# EAGLE schematic test_module (EAGLE 9.6.2)
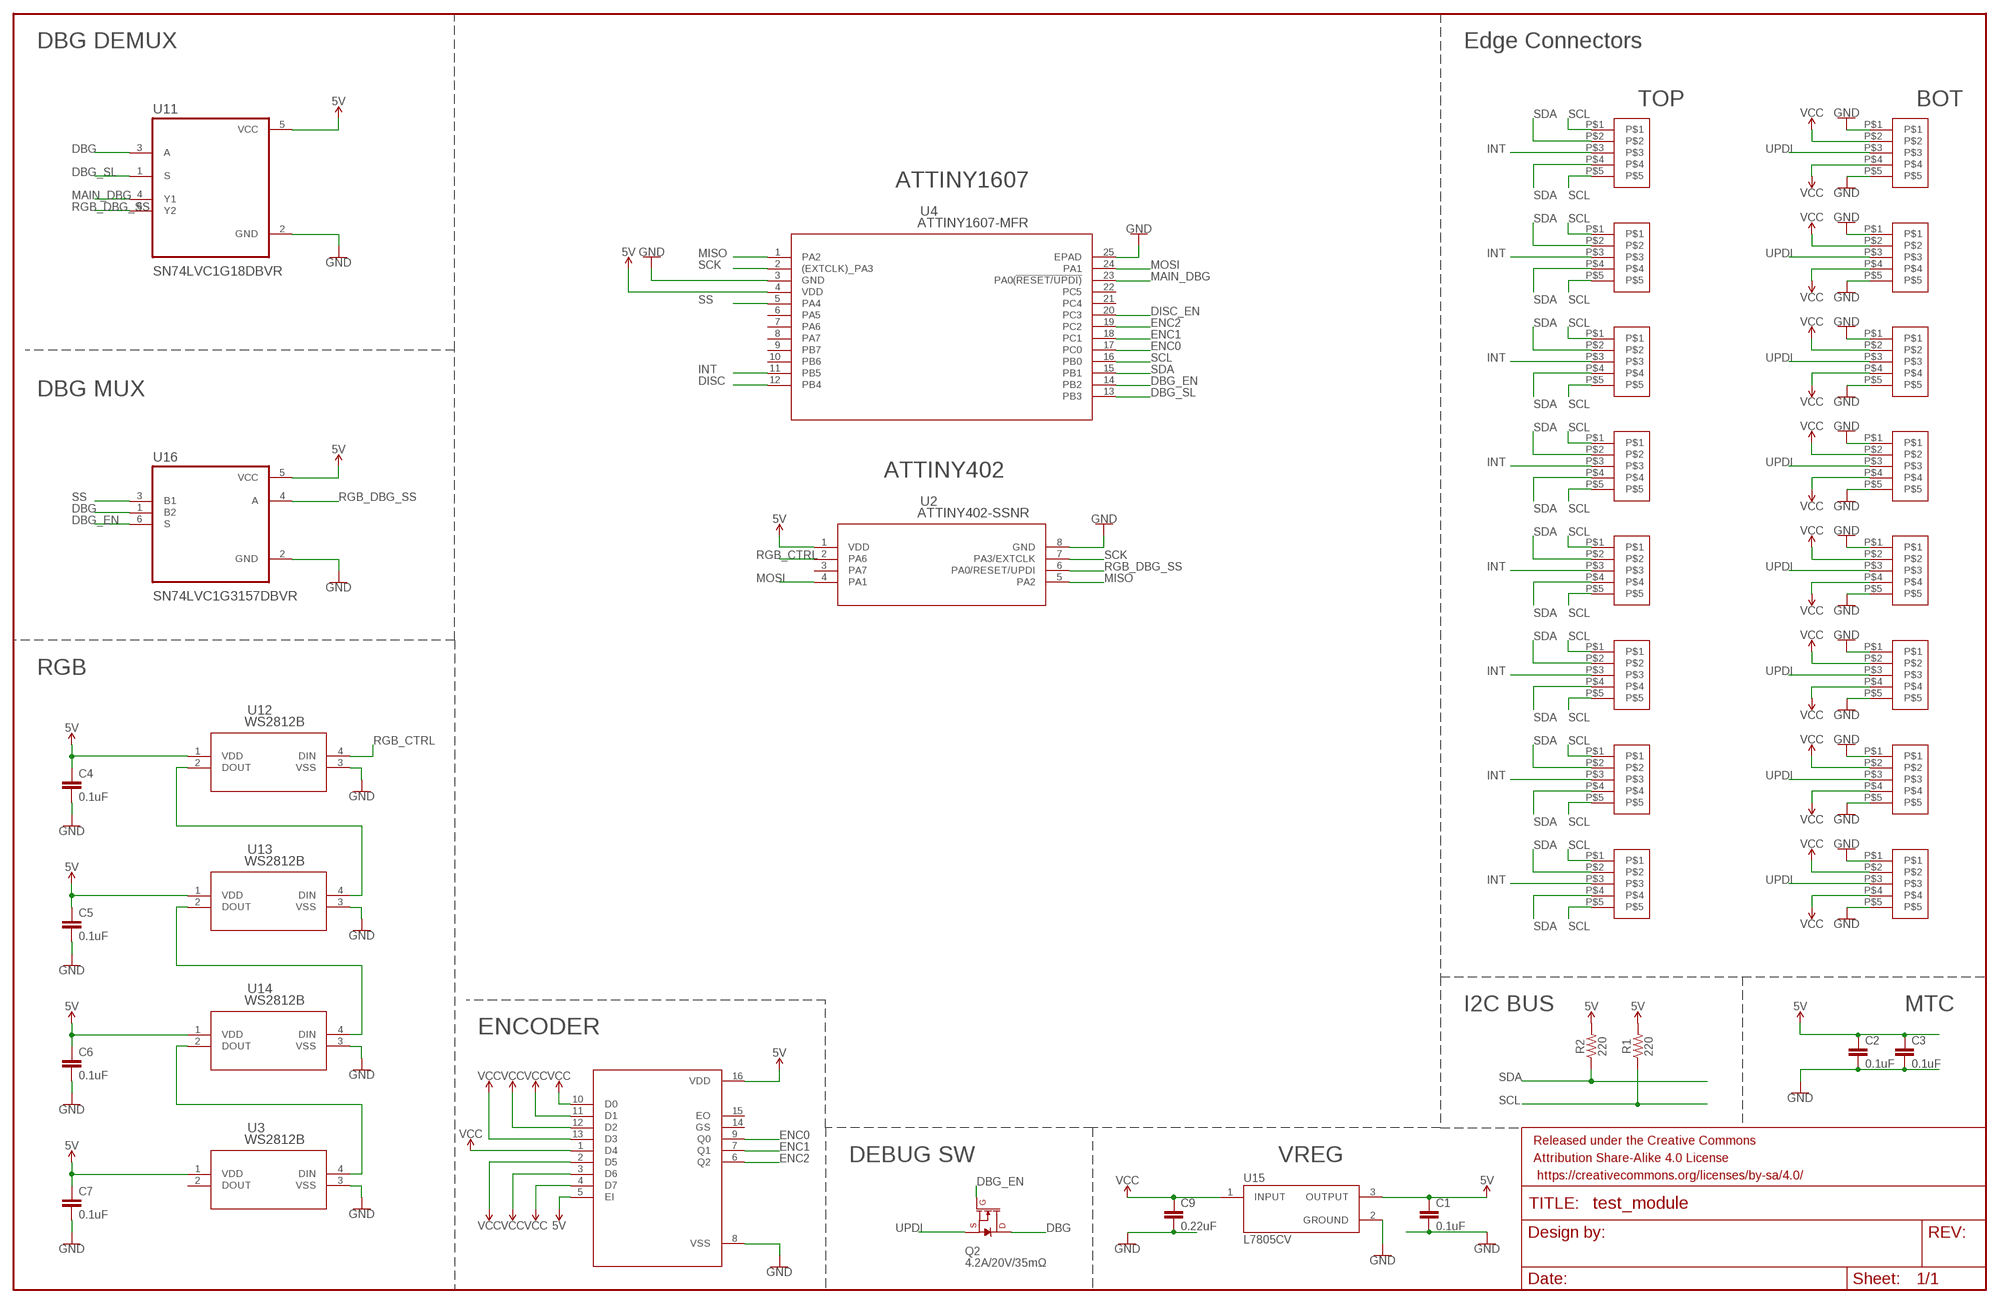
[diagram p0: schematic, sheet 1]

## Parts
C1  0.1uF  0.1UF-0603-25V-10%-X7R-WE  [0603]
C2  0.1uF  0.1UF-0603-25V-10%-X7R-WE  [0603]
C3  0.1uF  0.1UF-0603-25V-10%-X7R-WE  [0603]
C4  0.1uF  0.1UF-0603-25V-10%-X7R-WE  [0603]
C5  0.1uF  0.1UF-0603-25V-10%-X7R-WE  [0603]
C6  0.1uF  0.1UF-0603-25V-10%-X7R-WE  [0603]
C7  0.1uF  0.1UF-0603-25V-10%-X7R-WE  [0603]
C9  0.22uF  2.2UF-1206-50V-10%  [1206]
E1  5-PIN-EDGE-CONNECTOR  [5-PIN-EDGE-CONNECTOR]
E2  5-PIN-EDGE-CONNECTOR  [5-PIN-EDGE-CONNECTOR]
E3  5-PIN-EDGE-CONNECTOR  [5-PIN-EDGE-CONNECTOR]
E4  5-PIN-EDGE-CONNECTOR  [5-PIN-EDGE-CONNECTOR]
E5  5-PIN-EDGE-CONNECTOR  [5-PIN-EDGE-CONNECTOR]
E6  5-PIN-EDGE-CONNECTOR  [5-PIN-EDGE-CONNECTOR]
E7  5-PIN-EDGE-CONNECTOR  [5-PIN-EDGE-CONNECTOR]
E8  5-PIN-EDGE-CONNECTOR  [5-PIN-EDGE-CONNECTOR]
E9  5-PIN-EDGE-CONNECTOR  [5-PIN-EDGE-CONNECTOR]
E10  5-PIN-EDGE-CONNECTOR  [5-PIN-EDGE-CONNECTOR]
E11  5-PIN-EDGE-CONNECTOR  [5-PIN-EDGE-CONNECTOR]
E12  5-PIN-EDGE-CONNECTOR  [5-PIN-EDGE-CONNECTOR]
E13  5-PIN-EDGE-CONNECTOR  [5-PIN-EDGE-CONNECTOR]
E14  5-PIN-EDGE-CONNECTOR  [5-PIN-EDGE-CONNECTOR]
E15  5-PIN-EDGE-CONNECTOR  [5-PIN-EDGE-CONNECTOR]
E16  5-PIN-EDGE-CONNECTOR  [5-PIN-EDGE-CONNECTOR]
FRAME1  FRAME-LEDGER  [CREATIVE_COMMONS]
Q2  4.2A/20V/35mΩ  MOSFET-NCH-AO3404A  [SOT23-3]
R1  220  220OHM-0603-1/10W-1%  [0603]
R2  220  220OHM-0603-1/10W-1%  [0603]
U1  CD4532BM  [SOIC127P600X175-16N]
U2  ATTINY402-SSNR  [SOIC8_4P9X3P9MC_MCH]
U3  WS2812B  [WS2812B_WDS]
U4  ATTINY1607-MFR  [QFN24_4X4_MCH]
U11  SN74LVC1G18DBVR  [SOT95P280X145-6N]
U12  WS2812B  [WS2812B_WDS]
U13  WS2812B  [WS2812B_WDS]
U14  WS2812B  [WS2812B_WDS]
U15  L7805CV  [TO255P1040X460X1968-3]
U16  SN74LVC1G3157DBVR  [SOT95P280X145-6N]

## Nets
5V: C1.1 C2.1 C3.1 C4.1 C5.1 C6.1 C7.1 R1.2 R2.2 U1.5(EI) U1.16(VDD) U2.1(VDD) U3.1(VDD) U4.4(VDD) U11.5(VCC) U12.1(VDD) U13.1(VDD) U14.1(VDD) U15.3(OUTPUT) U16.5(VCC)
DBG: Q2.3(D) U11.3(A) U16.1(B2)
DBG_EN: Q2.1(G) U4.14(PB2) U16.6(S)
DBG_SL: U4.13(PB3) U11.1(S)
DISC: U4.12(PB4)
DISC_EN: U4.20(PC3)
ENC0: U1.9(Q0) U4.17(PC0)
ENC1: U1.7(Q1) U4.18(PC1)
ENC2: U1.6(Q2) U4.19(PC2)
GND: C1.2 C2.2 C3.2 C4.2 C5.2 C6.2 C7.2 C9.2 E5.P$1 E5.P$5 E6.P$1 E6.P$5 E7.P$1 E7.P$5 E8.P$1 E8.P$5 E9.P$1 E9.P$5 E10.P$1 E10.P$5 E11.P$1 E11.P$5 E12.P$1 E12.P$5 U1.8(VSS) U2.8(GND) U3.3(VSS) U4.3(GND) U4.25(EPAD) U11.2(GND) U12.3(VSS) U13.3(VSS) U14.3(VSS) U15.2(GROUND) U16.2(GND)
INT: E1.P$3 E2.P$3 E3.P$3 E4.P$3 E13.P$3 E14.P$3 E15.P$3 E16.P$3 U4.11(PB5)
MAIN_DBG: U4.23(PA0(!RESET/UPDI)) U11.4(Y1)
MISO: U2.5(PA2) U4.1(PA2)
MOSI: U2.4(PA1) U4.24(PA1)
N$1: U12.2(DOUT) U13.4(DIN)
N$2: U13.2(DOUT) U14.4(DIN)
N$3: U3.4(DIN) U14.2(DOUT)
RGB_CTRL: U2.2(PA6) U12.4(DIN)
RGB_DBG_SS: U2.6(PA0/RESET/UPDI) U11.6(Y2) U16.4(A)
SCK: U2.7(PA3/EXTCLK) U4.2((EXTCLK)_PA3)
SCL: E1.P$1 E1.P$5 E2.P$1 E2.P$5 E3.P$1 E3.P$5 E4.P$1 E4.P$5 E13.P$1 E13.P$5 E14.P$1 E14.P$5 E15.P$1 E15.P$5 E16.P$1 E16.P$5 R1.1 U4.16(PB0)
SDA: E1.P$2 E1.P$4 E2.P$2 E2.P$4 E3.P$2 E3.P$4 E4.P$2 E4.P$4 E13.P$2 E13.P$4 E14.P$2 E14.P$4 E15.P$2 E15.P$4 E16.P$2 E16.P$4 R2.1 U4.15(PB1)
SS: U4.5(PA4) U16.3(B1)
UPDI: E5.P$3 E6.P$3 E7.P$3 E8.P$3 E9.P$3 E10.P$3 E11.P$3 E12.P$3 Q2.2(S)
VCC: C9.1 E5.P$2 E5.P$4 E6.P$2 E6.P$4 E7.P$2 E7.P$4 E8.P$2 E8.P$4 E9.P$2 E9.P$4 E10.P$2 E10.P$4 E11.P$2 E11.P$4 E12.P$2 E12.P$4 U1.1(D4) U1.2(D5) U1.3(D6) U1.4(D7) U1.10(D0) U1.11(D1) U1.12(D2) U1.13(D3) U15.1(INPUT)
Unconnected: U1.14(GS) U1.15(EO) U2.3(PA7) U3.2(DOUT) U4.6(PA5) U4.7(PA6) U4.8(PA7) U4.9(PB7) U4.10(PB6) U4.21(PC4) U4.22(PC5)

## Notes on the sheet
- DBG DEMUX | Edge Connectors
- TOP | BOT
- ATTINY1607
- DBG MUX
- ATTINY402
- RGB
- I2C BUS | MTC
- ENCODER
- DEBUG SW | VREG

## Library data of the parts
C1-C7 = SparkFun-Capacitors:0.1UF: 0.1µF ceramic capacitors A capacitor is a passive two-terminal electrical component used to store electrical energy temporarily in an electric field.; PROD_ID: CAP-16503
C9 = SparkFun-Capacitors:2.2UF: 2.2µF ceramic capacitors A capacitor is a passive two-terminal electrical component used to store electrical energy temporarily in an electric field.; PROD_ID: CAP-10009; VALUE: 2.2uF
E1-E16 = EDGE-CONNECTORS:5-PIN-EDGE-CONNECTOR
FRAME1 = SparkFun-Aesthetics:FRAME-LEDGER: Schematic Frame - Ledger Standard 11x14 US Ledger frame
Q2 = SparkFun-DiscreteSemi:MOSFET-NCH: N-channel MOSFETs Voltage controlled devices that allow control of high current outputs. SparkFun Products: SparkFun OpenScale <https://www.sparkfun.com/products/13261> SparkFun Digital Sandbox <https://www.sparkfun.com/products/12651> SparkFun Monster Moto Shield <https://www.sparkfun.com/products/10182> SparkFun MOSFET Power Controller <https://www.sparkfun.com/products/11214>; PROD_ID: TRANS-12988; VALUE: 5.8A/30V/35mΩ
R1 R2 = SparkFun-Resistors:220OHM: 220Ω resistor A resistor is a passive two-terminal electrical component that implements electrical resistance as a circuit element. Resistors act to reduce current flow, and, at the same time, act to lower voltage levels within circuits. - Wikipedia; PROD_ID: RES-07861
U1 = CD4532BM:CD4532BM
U2 = ATTINY402-SSNR:ATTINY402-SSNR; COPYRIGHT: Copyright (C) 2024 Ultra Librarian. All rights reserved.; MANUFACTURER_PART_NUMBER: ATTINY402-SSNR; MFR_NAME: Microchip
U3 U12-U14 = WS2812B:WS2812B; COPYRIGHT: Copyright (C) 2024 Ultra Librarian. All rights reserved.; MANUFACTURER_PART_NUMBER: WS2812B; MFR_NAME: Worldsemi
U4 = ATTINY1607-MFR:ATTINY1607-MFR; COPYRIGHT: Copyright (C) 2024 Ultra Librarian. All rights reserved.; DIGIKEY_PART_NUMBER_1: ATTINY1607-MFRCT-ND; DIGIKEY_PART_NUMBER_2: ATTINY1607-MFRDKR-ND; DIGIKEY_PART_NUMBER_3: ATTINY1607-MFRTR-ND; MANUFACTURER_PART_NUMBER: ATTINY1607-MFR; MFR_NAME: Microchip
U11 = SN74LVC1G18DBVR:SN74LVC1G18DBVR: Check availability <https://pricing.snapeda.com/parts/SN74LVC1G18DBVR/Texas%20Instruments/view-part?ref=eda>; AVAILABILITY: In Stock; CHECK_PRICES: https://www.snapeda.com/parts/SN74LVC1G18DBVR/Texas+Instruments/view-part/?ref=eda; DESCRIPTION: One of Two Noninverting Demultiplexer with 3-State Deselected Output; MF: Texas Instruments; MP: SN74LVC1G18DBVR; PACKAGE: SOT-23-6 Texas Instruments; PRICE: None; PURCHASE-URL: https://www.snapeda.com/api/url_track_click_mouser/?unipart_id=411270&manufacturer=Texas Instruments&part_name=SN74LVC1G18DBVR&search_term=None; SNAPEDA_LINK: https://www.snapeda.com/parts/SN74LVC1G18DBVR/Texas+Instruments/view-part/?ref=snap
U15 = L7805CV:L7805CV: Standard Regulator Pos 5V 1.5A 3-Pin(3+Tab) TO-220 Standard Regulator Pos 5V 1.5A 3-Pin(3+Tab) TO-220 Check availability <https://pricing.snapeda.com/parts/L7805CV-/STMicroelectronics/view-part?ref=eda>; AVAILABILITY: In Stock; CHECK_PRICES: https://www.snapeda.com/parts/L7805CV-/STMicroelectronics/view-part/?ref=eda; DESCRIPTION: Linear Voltage Regulator IC Positive Fixed 1 Output 1.5A TO-220; MF: STMicroelectronics; MP: L7805CV-; PACKAGE: TO-220-3 STMicroelectronics; PRICE: None; SNAPEDA_LINK: https://www.snapeda.com/parts/L7805CV-/STMicroelectronics/view-part/?ref=snap
U16 = SN74LVC1G3157DBVR:SN74LVC1G3157DBVR: Check availability <https://pricing.snapeda.com/parts/SN74LVC1G3157DBVR/Texas%20Instruments/view-part?ref=eda>; AVAILABILITY: In Stock; CHECK_PRICES: https://www.snapeda.com/parts/SN74LVC1G3157DBVR/Texas+Instruments/view-part/?ref=eda; DESCRIPTION: 5-V, 2:1 (SPDT), 1-channel general-purpose analog switch; MF: Texas Instruments; MP: SN74LVC1G3157DBVR; PACKAGE: SOT-23-6 Texas Instruments; PRICE: None; PURCHASE-URL: https://www.snapeda.com/api/url_track_click_mouser/?unipart_id=366071&manufacturer=Texas Instruments&part_name=SN74LVC1G3157DBVR&search_term=None; SNAPEDA_LINK: https://www.snapeda.com/parts/SN74LVC1G3157DBVR/Texas+Instruments/view-part/?ref=snap